# EAGLE design BPW5019-Joystick (EAGLE 5.06)
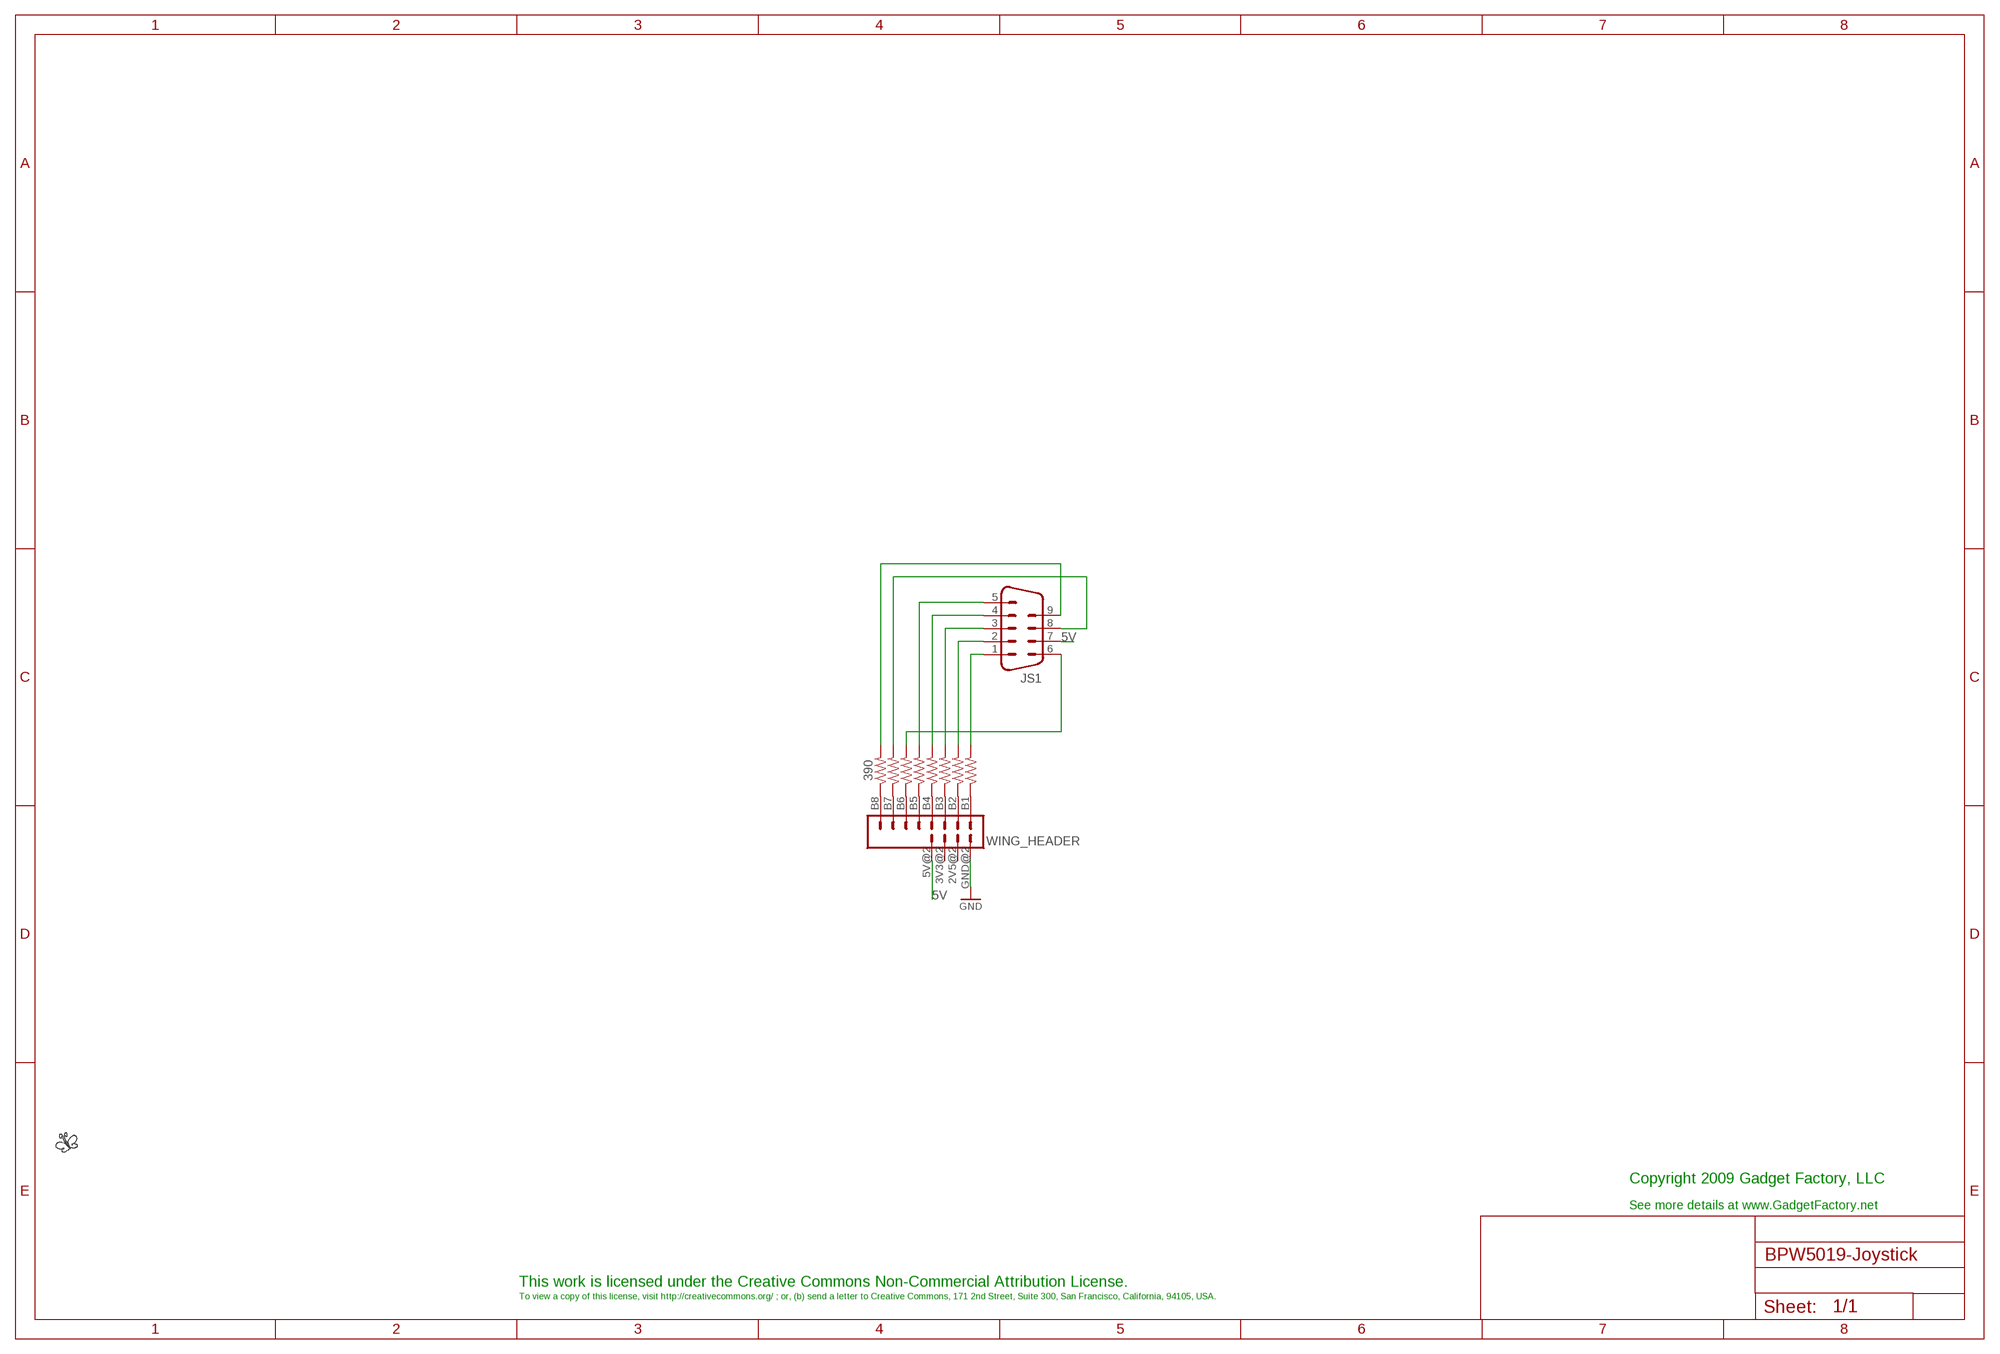
[diagram p0: schematic, sheet 1]

## Parts
JS1  M09HP  [M09HP]
LOGO2  BUTTERFLY_LOGO  [BUTTERFLY_LOGO]
R1  390  R-US_0204/7  [0204/7]
R2  390  R-US_0204/7  [0204/7]
R3  390  R-US_0204/7  [0204/7]
R4  390  R-US_0204/7  [0204/7]
R5  390  R-US_0204/7  [0204/7]
R6  390  R-US_0204/7  [0204/7]
R7  390  R-US_0204/7  [0204/7]
R8  390  R-US_0204/7  [0204/7]
WING_HEADER  WING_8BIT  [WINGSIDE_8BIT]

## Nets
5V: JS1.7 WING_HEADER.5V@2(5V)
GND: WING_HEADER.GND@2(GND)
N$1: R1.1 WING_HEADER.B1
N$2: R2.1 WING_HEADER.B2
N$3: R3.1 WING_HEADER.B3
N$4: R4.1 WING_HEADER.B4
N$5: R5.1 WING_HEADER.B5
N$6: R6.1 WING_HEADER.B6
N$7: R7.1 WING_HEADER.B7
N$8: R8.1 WING_HEADER.B8
N$9: JS1.1 R1.2
N$10: JS1.2 R2.2
N$11: JS1.3 R3.2
N$12: JS1.4 R4.2
N$13: JS1.5 R5.2
N$14: JS1.9 R8.2
N$15: JS1.6 R6.2
N$16: JS1.8 R7.2
Unconnected: WING_HEADER.2V5@2(2V5) WING_HEADER.3V3@2(3V3)

## Notes on the sheet
- Copyright 2009 Gadget Factory, LLC
- See more details at www.GadgetFactory.net
- This work is licensed under the Creative Commons Non-Commercial Attribution License.
- To view a copy of this license, visit http://creativecommons.org/ ; or, (b) send a letter to Creative Commons, 171 2nd Street, Suite 300, San Francisco, California, 94105, USA.

## Library data of the parts
JS1 = con-subd:M09: SUB-D
LOGO2 = GadgetFactory_Pub:BUTTERFLY_LOGO
R1-R8 = resistor:R-US_: RESISTOR, American symbol
WING_HEADER = GadgetFactory_Pub:WING_8BIT

## Board
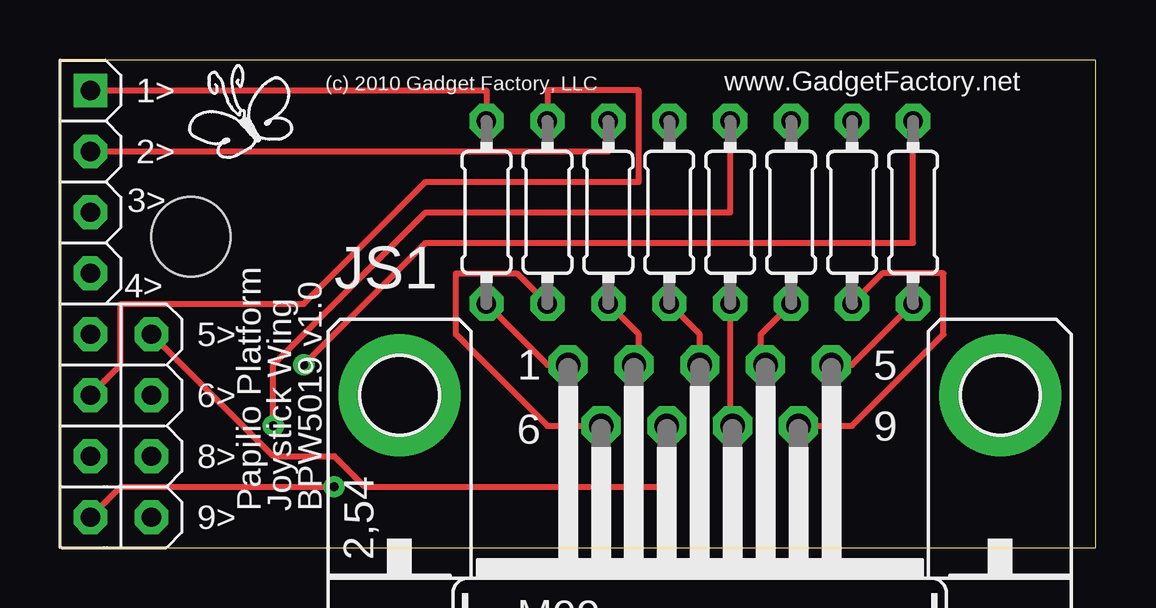
[diagram p1: board, top side]
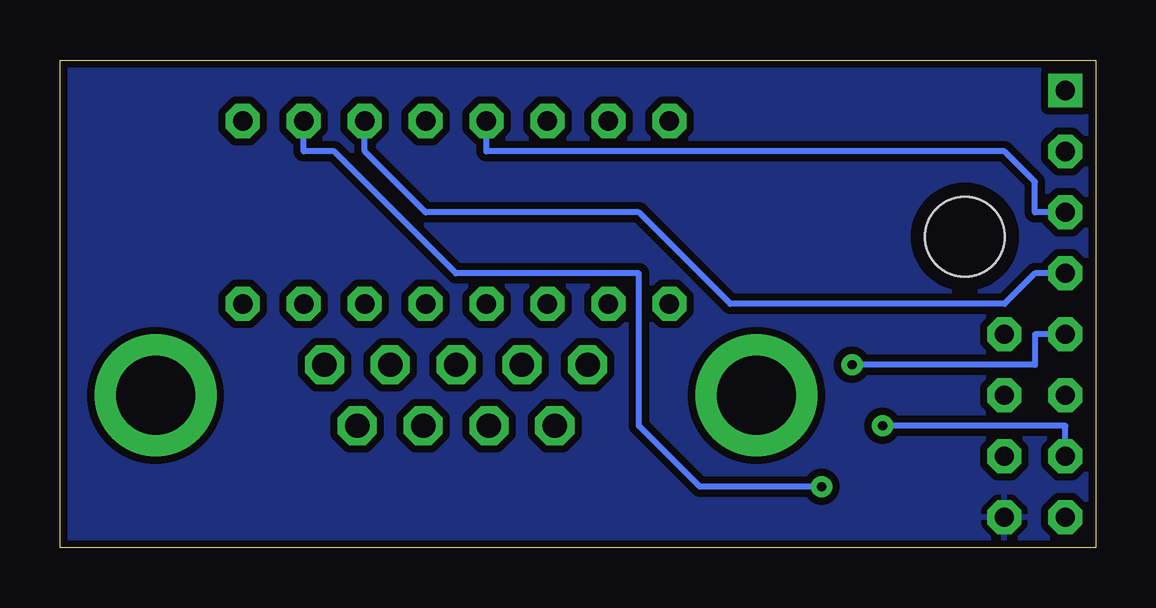
[diagram p2: board, bottom side, seen from below]

Size 43.18 x 20.32 mm. Coordinates in mm from the lower left corner, seen from the top.
Outline: 0,0 43.18,0 43.18,20.32 0,20.31 0,0
Copper layers (1*16): Top 0.035mm / dielectric 1.5mm / Bottom 0.035mm
Design rules "SparkFun_Derived_GoldePheonix_10mil": minimum track width 10mil, minimum drill 15mil, track to track 8mil, track to pad 8mil, pad to pad 8mil, via to via 8mil, smd to smd 8mil, copper to edge 10mil, drill to drill 8mil, minimum pad ring 12mil, minimum via ring 10mil, stop-mask expansion 4mil, vias tented up to drill 18mil, thermal gap 10mil

### Footprints (pad centres in the part's own frame; a part is rotated, then mirrored left to right if it is on the bottom)
M09HP = drill 1.016 octagon: 1 -5.486,1.27; 2 -2.743,1.27; 3 0,1.27; 4 2.743,1.27; 5 5.486,1.27; 6 -4.115,-1.27; 7 -1.372,-1.27; 8 1.372,-1.27; 9 4.115,-1.27 | drill 3.302 pad 5.08 round: G1 -12.522,0; G2 12.522,0
0204/7 = drill 0.813 octagon: 1 -3.81,0; 2 3.81,0
WINGSIDE_8BIT = drill 0.8 octagon: 2V5@2 16.51,3.81; 3V3@2 13.97,3.81; 5V@2 11.43,3.81; B2 3.81,1.27; B3 6.35,1.27; B4 8.89,1.27; B5 11.43,1.27; B6 13.97,1.27; B7 16.51,1.27; B8 19.05,1.27; GND@2 19.05,3.81 | drill 0.8 square: B1 1.27,1.27 | hole 3.302: 7.366,5.461

### Placement (x,y rotation side)
JS1  26.67,6.35 0 top
LOGO2  7.62,17.65 0 top
R1  17.78,13.97 270 top
R2  22.86,13.97 270 top
R3  25.4,13.97 270 top
R4  30.48,13.97 270 top
R5  35.56,13.97 270 top
R6  20.32,13.97 270 top
R7  27.94,13.97 270 top
R8  33.02,13.97 270 top
WING_HEADER  0,20.32 270 top

### Tracks (layer width: path | path; a pad name or v marks a point on that pad's centre or on a via)
5V
  Top 0.254: WING_HEADER.5V@2 8.89,3.81 11.43,3.81 12.7,2.54 25.4,2.54 25.4,5.08 JS1.7
GND
  pour Bottom (isolate 0.305): 0,20.32 43.18,20.32 43.18,0 0,0
N$1
  Top 0.254: WING_HEADER.B1 17.78,19.05 R1.1
N$2
  Top 0.254: WING_HEADER.B2 22.86,16.51 R2.1
N$3
  Bottom 0.254: WING_HEADER.B3 2.54,13.97 2.54,15.24 3.81,16.51 25.4,16.51 R3.1
N$4
  Bottom 0.254: WING_HEADER.B4 2.54,11.43 3.81,10.16 15.24,10.16 19.05,13.97 27.94,13.97 30.48,16.51 R4.1
N$5  (via drill 0.38)
  Top 0.254: v10.16,7.62 15.24,12.7 35.56,12.7 R5.1
  Bottom 0.254: WING_HEADER.B5 2.54,8.89 2.54,7.62 v10.16,7.62
N$6
  Top 0.254: WING_HEADER.B6 2.54,7.62 2.54,10.16 10.16,10.16 15.24,15.24 24.13,15.24 24.13,19.05 20.32,19.05 R6.1
N$7  (via drill 0.38)
  Top 0.254: v8.89,5.08 8.89,7.62 15.24,13.97 27.94,13.97 R7.1
  Bottom 0.254: WING_HEADER.B7 1.27,5.08 v8.89,5.08
N$8  (via drill 0.38)
  Top 0.254: WING_HEADER.B8 2.54,2.54 v11.43,2.54
  Bottom 0.254: v11.43,2.54 16.51,2.54 19.05,5.08 19.05,11.43 26.67,11.43 31.75,16.51 33.02,16.51 R8.1
N$9
  Top 0.254: R1.2 20.32,7.62 JS1.1 21.59,7.62
N$10
  Top 0.254: R2.2 24.13,8.89 24.13,7.62 JS1.2
N$11
  Top 0.254: R3.2 26.67,8.89 JS1.3
N$12
  Top 0.254: R4.2 29.21,8.89 29.21,7.62 JS1.4
N$13
  Top 0.254: R5.2 33.02,7.62 JS1.5 31.75,7.62
N$14
  Top 0.254: R8.2 34.29,11.43 36.83,11.43 36.83,8.89 33.02,5.08 JS1.9 30.48,5.08
N$15
  Top 0.254: R6.2 19.05,11.43 16.51,11.43 16.51,8.89 20.32,5.08 JS1.6 22.86,5.08
N$16
  Top 0.254: R7.2 27.94,5.08 JS1.8

### Text on the board
tPlace: 1> | (c) 2010 Gadget Factory, LLC | www.GadgetFactory.net | 2> | 3> | 4> | 5> | 6> | 8> | Papilio Platform | Joystick Wing | BPW5019 v1.0 | 9>